# EAGLE schematic board2 (EAGLE 7.6.0)
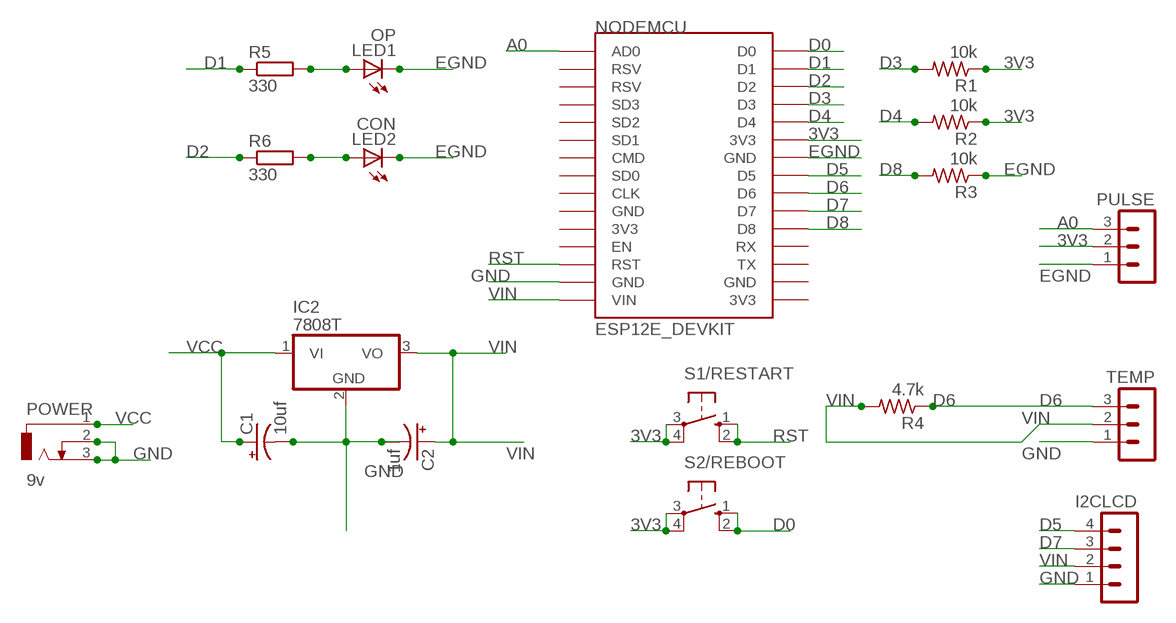
[diagram p0: schematic, sheet 1]

## Parts
C1  10uf  CPOL-USE2.5-5  [E2,5-5]
C2  1uf  CPOL-USE2.5-5  [E2,5-5]
I2CLCD  MA04-1  [MA04-1]
IC2  7808T  [TO220H]
LED1  OP  TLLG4400  [LED3MM]
LED2  CON  TLLR4400  [LED3MM]
NODEMCU  ESP12E_DEVKIT  [ESP12E_DEVKIT]
POWER  9v  DCJ0303  [DCJ0303]
PULSE  MA03-1  [MA03-1]
R1  10k  R-US_0207/7  [0207/7]
R2  10k  R-US_0207/7  [0207/7]
R3  10k  R-US_0207/7  [0207/7]
R4  4.7k  R-US_0207/7  [0207/7]
R5  330  R-EU_0204/5  [0204/5]
R6  330  R-EU_0204/5  [0204/5]
S1/RESTART  10-XX  [B3F-10XX]
S2/REBOOT  10-XX  [B3F-10XX]
TEMP  MA03-1  [MA03-1]

## Nets
3V3: NODEMCU.3V3@1(3V3) PULSE.2 R1.1 R2.1 S1/RESTART.3(P) S1/RESTART.4(P1) S2/REBOOT.3(P) S2/REBOOT.4(P1)
A0: NODEMCU.AD0 PULSE.3
D0: NODEMCU.D0 S2/REBOOT.1(S) S2/REBOOT.2(S1)
D1: NODEMCU.D1 R5.1
D2: NODEMCU.D2 R6.1
D3: NODEMCU.D3 R1.2
D4: NODEMCU.D4 R2.2
D5: I2CLCD.4 NODEMCU.D5
D6: NODEMCU.D6 R4.1 TEMP.3
D7: I2CLCD.3 NODEMCU.D7
D8: NODEMCU.D8 R3.2
EGND: LED1.K(C) LED2.K(C) NODEMCU.GND@2(GND) PULSE.1 R3.1
GND: C1.- C2.- I2CLCD.1 IC2.2(GND) NODEMCU.GND@1(GND) POWER.2 POWER.3 TEMP.1
N$1: LED1.A R5.2
N$2: LED2.A R6.2
RST: NODEMCU.RST S1/RESTART.1(S) S1/RESTART.2(S1)
VCC: C1.+ IC2.1(VI) POWER.1
VIN: C2.+ I2CLCD.2 IC2.3(VO) NODEMCU.VIN R4.2 TEMP.2
Unconnected: NODEMCU.3V3@0(3V3) NODEMCU.3V3@2(3V3) NODEMCU.CLK NODEMCU.CMD NODEMCU.EN NODEMCU.GND@0(GND) NODEMCU.GND@3(GND) NODEMCU.RSV@0(RSV) NODEMCU.RSV@1(RSV) NODEMCU.RX NODEMCU.SD0 NODEMCU.SD1 NODEMCU.SD2 NODEMCU.SD3 NODEMCU.TX

## Library data of the parts
C1 C2 = rcl:CPOL-US: POLARIZED CAPACITOR, American symbol
I2CLCD = con-lstb:MA04-1: PIN HEADER; OC_FARNELL: unknown; OC_NEWARK: unknown
IC2 = linear:78*: Positive VOLTAGE REGULATOR Source: http://cache.national.com/ds/LM/LM78L05.pdf http://www.fairchildsemi.com/ds/LM/LM7805.pdf
LED1 = led:TLLG4400: Low Current (2mA) LED 3 mm Tinted Diffused Package color GREEN Source: Data sheet <http://www.farnell.com/datasheets/391098.pdf>; MF: VISHAY SEMICONDUCTOR; OC_FARNELL: 1612435
LED2 = led:TLLR4400: Low Current (2mA) LED 3 mm Tinted Diffused Package color RED Source: Data sheet <http://www.farnell.com/datasheets/391100.pdf>; MF: VISHAY SEMICONDUCTOR; OC_FARNELL: 1612437
NODEMCU = ESP12E_DEVKIT:ESP12E_DEVKIT: ESP12E DEVKIT BOARD
POWER = con-jack:DCJ0303: DC POWER JACK Source: DCJ0303.pdf; OC_FARNELL: unknown; OC_NEWARK: unknown
PULSE TEMP = con-lstb:MA03-1: PIN HEADER; OC_FARNELL: unknown; OC_NEWARK: unknown
R1 R3 = rcl:R-US_: RESISTOR, American symbol
R2 R4 = resistor:R-US_: RESISTOR, American symbol
R5 R6 = resistor:R-EU_: RESISTOR, European symbol
S1/RESTART S2/REBOOT = switch-omron:10-XX: OMRON SWITCH; MPN: B3F-1000; OC_FARNELL: 176432; OC_NEWARK: 36M3542

## Net classes
0 default: width 0.406 mm, clearance 0.205 mm